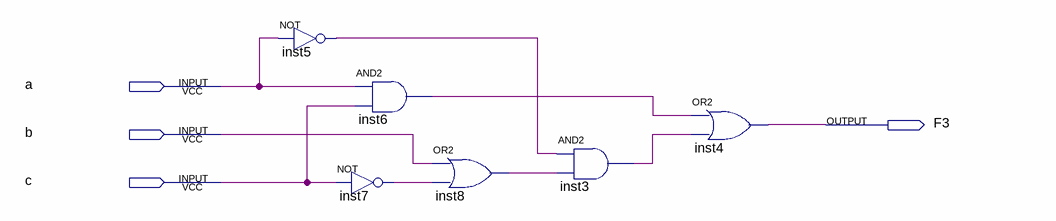
[diagram p0: schematic sheet]
// Quartus schematic Sistema03.bdf as structural Verilog: 6 symbols, 4 pins
module Sistema03 (
  input  a,
  input  b,
  input  c,
  output F3
);

  wire inst3_out, inst5_out, inst6_out, inst7_out, inst8_out;

  not inst5 (inst5_out, a);
  not inst7 (inst7_out, c);
  and inst6 (inst6_out, a, c);
  or inst8 (inst8_out, b, inst7_out);
  and inst3 (inst3_out, inst5_out, inst8_out);
  or inst4 (F3, inst6_out, inst3_out);
endmodule
